# Altium project Current_source_koncar.PrjPcb (part 4 of 4)

## Sheet connectors.SchDoc
size 381 x 241 mm; SheetNumber: 9; SheetTotal: 10
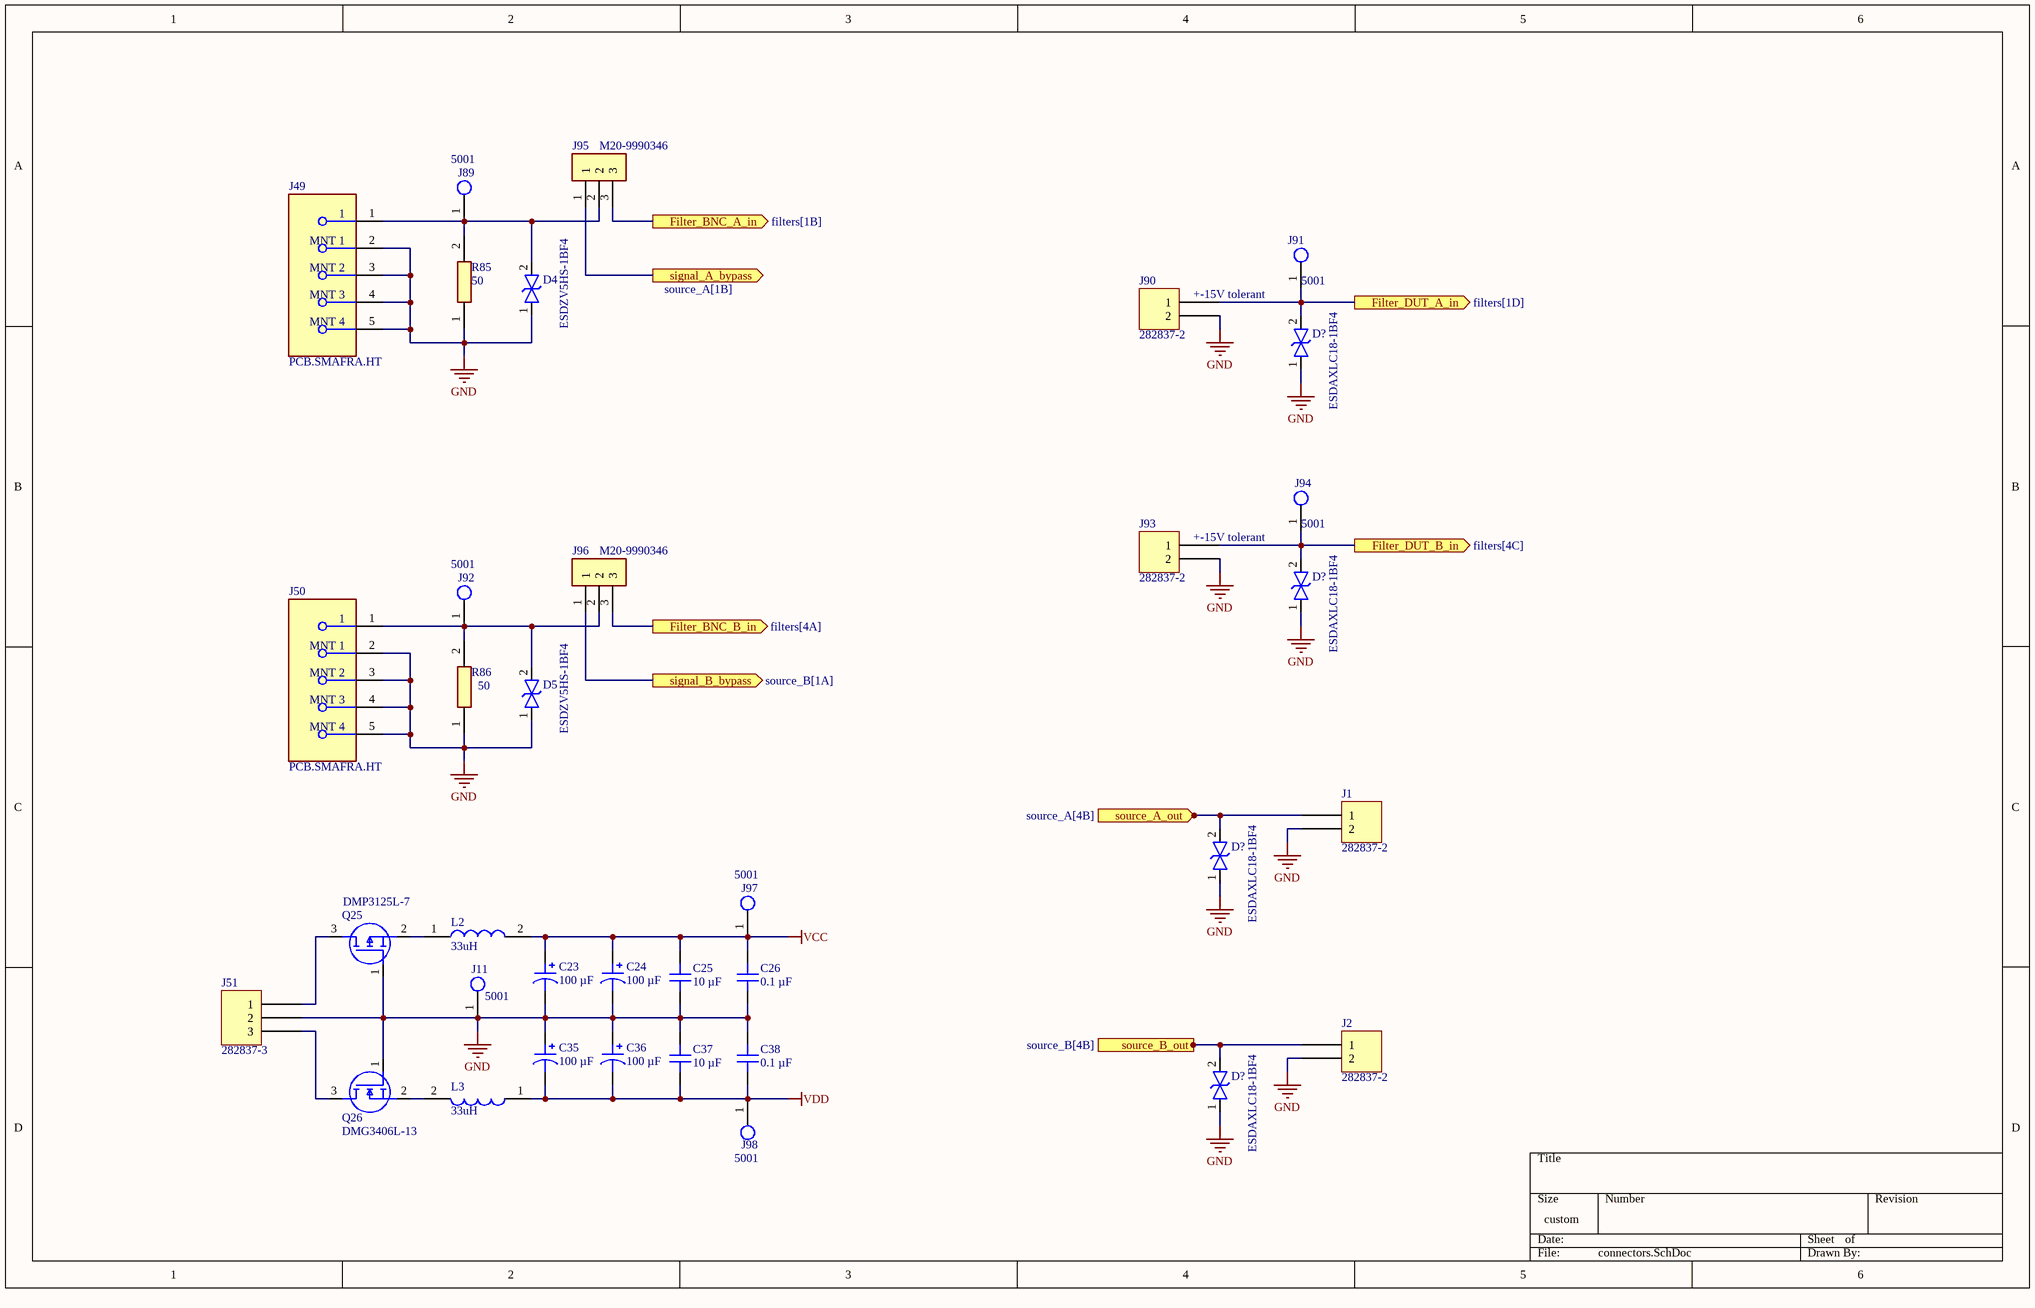
[diagram p9: connectors.SchDoc]

### Parts
(Parts that share a designator on the sheet are numbered #1, #2 ... from top to bottom, then left to right.)
C23  100 µF  [CAP ALSMD 8.3MM H10.5MM]
C24  100 µF  [CAP ALSMD 8.3MM H10.5MM]
C25  10 µF  [CAP 1206_3216 - 0.8MM]
C26  0.1 µF  [CAP 1206_3216 - 0.8MM]
C35  100 µF  [CAP ALSMD 8.3MM H10.5MM]
C36  100 µF  [CAP ALSMD 8.3MM H10.5MM]
C37  10 µF  [CAP 1206_3216 - 0.8MM]
C38  0.1 µF  [CAP 1206_3216 - 0.8MM]
D4  ESDZV5HS-1BF4  [ESDZV5HS1BF4]
D5  ESDZV5HS-1BF4  [ESDZV5HS1BF4]
D?#1  ESDAXLC18-1BF4  [ESDAXLC181BF4]
D?#2  ESDAXLC18-1BF4  [ESDAXLC181BF4]
D?#3  ESDAXLC18-1BF4  [ESDAXLC181BF4]
D?#4  ESDAXLC18-1BF4  [ESDAXLC181BF4]
J1  282837-2  [TE 282837-2]
J2  282837-2  [TE 282837-2]
J11  5001  [FP-5001-MFG]
J49  PCB.SMAFRA.HT  [FP-PCB_SMAFRA_HT-MFG]
J50  PCB.SMAFRA.HT  [FP-PCB_SMAFRA_HT-MFG]
J51  282837-3  [TE 282837-3]
J89  5001  [FP-5001-MFG]
J90  282837-2  [TE 282837-2]
J91  5001  [FP-5001-MFG]
J92  5001  [FP-5001-MFG]
J93  282837-2  [TE 282837-2]
J94  5001  [FP-5001-MFG]
J95  M20-9990346  [HDRV3W64P0X254_1X3_762X254X864P]
J96  M20-9990346  [HDRV3W64P0X254_1X3_762X254X864P]
J97  5001  [FP-5001-MFG]
J98  5001  [FP-5001-MFG]
L2  33uH  [INDPM116102X400N]
L3  33uH  [INDPM116102X400N]
Q25  DMP3125L-7  [SOT96P240X110-3N]
Q26  DMG3406L-13  [SOT96P240X110-3N]
R85  50  [RESC6332X65N]
R86  50  [RESC6332X65N]

### Ports
Filter_BNC_A_in (out, see filters[1B]), Filter_BNC_B_in (out, see filters[4A]), Filter_DUT_A_in (out, see filters[1D]), Filter_DUT_B_in (out, see filters[4C]), signal_A_bypass (out, see source_A[1B]), signal_B_bypass (out, see source_B[1A]), source_A_out (in, see source_A[4B]), source_B_out (in, see source_B[4B])

### Nets
GND: C23.2 C24.2 C25.1 C26.1 C35.1 C36.1 C37.2 C38.2 D4.1 D5.1 D?#1.1 D?#2.1 D?#3.1 D?#4.1 J1.2 J2.2 J11.1 J49.2(MNT_1) J49.3(MNT_2) J49.4(MNT_3) J49.5(MNT_4) J50.2(MNT_1) J50.3(MNT_2) J50.4(MNT_3) J50.5(MNT_4) J51.2 J90.2 J93.2 Q25.1(G) Q26.1(G) R85.1 R86.1
VCC: C23.1 C24.1 C25.2 C26.2 J97.1 L2.2
VDD: C35.2 C36.2 C37.1 C38.1 J98.1 L3.1
NetD4_2: D4.2 J49.1 J89.1 J95.2 R85.2
NetD5_2: D5.2 J50.1 J92.1 J96.2 R86.2
NetD?#1_2: D?#1.2 J90.1 J91.1 ; port Filter_DUT_A_in
NetD?#2_2: D?#2.2 J93.1 J94.1 ; port Filter_DUT_B_in
NetD?#3_2: D?#3.2 J1.1 ; port source_A_out
NetD?#4_2: D?#4.2 J2.1 ; port source_B_out
NetJ51_1: J51.1 Q25.3(D)
NetJ51_3: J51.3 Q26.3(D)
NetJ95_1: J95.1 ; port signal_A_bypass
NetJ95_3: J95.3 ; port Filter_BNC_A_in
NetJ96_1: J96.1 ; port signal_B_bypass
NetJ96_3: J96.3 ; port Filter_BNC_B_in
NetL2_1: L2.1 Q25.2(S)
NetL3_2: L3.2 Q26.2(S)

### Notes on the sheet
- (near J90) +-15V tolerant
- (near J93) +-15V tolerant

### Library data of the parts
C23 C24 C35 C36 = 50TZV100M8X10.5: CAP ALUM 100UF 20% 50V SMD; manufacturer: Rubycon; Impedance: 340 mOhms; Lifetime @ Temp.: 2000 Hrs @ 105°C; Polarization: Polar; Ripple Current @ High Frequency: 350 mA @ 100 kHz; Ripple Current @ Low Frequency: 175 mA @ 120 Hz; Surface Mount Land Size: 0.327" L x 0.327" W (8.30mm x 8.30mm); Part Number: 50TZV100M8X10.5; Applications: Automotive; Capacitance: 100 µF; componentlink1description: Datasheet; componentlink1url: http://www.rubycon.co.jp/en/catalog/e_pdfs/aluminum/e_tzv.pdf; componentlink2description: DigiKey Link; componentlink2url: https://www.digikey.com/en/products/detail/rubycon/50TZV100M8X10-5/3134931; Device Package: Radial, Can - SMD; Height - Seated (Max): 0.413" (10.50mm); lastupdated: 6/3/2024 20:15:48; Lifecycle Status: Active; Minimum Order: 1; Mounting Type: Surface Mount; Operating Temperature: -55°C ~ 105°C; Package / Case: Radial, Can - SMD; packaging: TapeAndReel; partid: 7533; Part Status: Active; price: 0.16; Ratings: AEC-Q200; series: TZV; Size / Dimension: 0.315" Dia (8.00mm); Supplier 1: DigiKey; Supplier Part Number 1: 1189-1651-1-ND; Tolerance: ±20%; value: 100 µF; Voltage - Rated: 50 V
C25 C37 = 885012208069: CAP CER 10UF 25V X7R 1206; manufacturer: Würth Elektronik; Tolerance: ±10%; Part Number: 885012208069; Capacitance: 10 µF; Applications: General Purpose; componentlink1description: Datasheet; componentlink1url: https://katalog.we-online.de/pbs/datasheet/885012208069.pdf; componentlink2description: DigiKey Link; componentlink2url: https://www.digikey.com/en/products/detail/würth-elektronik/885012208069/5453429; Device Package: 1206 (3216 Metric); lastupdated: 6/4/2024 19:10:32; Lifecycle Status: Active; Minimum Order: 1; Mounting Type: Surface Mount, MLCC; Operating Temperature: -55°C ~ 125°C; Package / Case: 1206 (3216 Metric); packaging: TapeAndReel; partid: 43199; Part Status: Active; price: 0.40; series: WCAP-CSGP; Size / Dimension: 0.126" L x 0.063" W (3.20mm x 1.60mm); Supplier 1: DigiKey; Supplier Part Number 1: 732-7574-1-ND; Temperature Coefficient: X7R; Thickness (Max): 0.075" (1.90mm); value: 10 µF; Voltage - Rated: 25V
C26 C38 = 885012208087: CAP CER 0.1UF 50V X7R 1206; manufacturer: Würth Elektronik; Tolerance: ±10%; Part Number: 885012208087; Capacitance: 0.1 µF; Applications: General Purpose; componentlink1description: Datasheet; componentlink1url: https://katalog.we-online.de/pbs/datasheet/885012208087.pdf; componentlink2description: DigiKey Link; componentlink2url: https://www.digikey.com/en/products/detail/würth-elektronik/885012208087/5453982; Device Package: 1206 (3216 Metric); lastupdated: 6/4/2024 19:10:27; Lifecycle Status: Active; Minimum Order: 1; Mounting Type: Surface Mount, MLCC; Operating Temperature: -55°C ~ 125°C; Package / Case: 1206 (3216 Metric); packaging: TapeAndReel; partid: 20879; Part Status: Active; price: 0.06; series: WCAP-CSGP; Size / Dimension: 0.126" L x 0.063" W (3.20mm x 1.60mm); Supplier 1: DigiKey; Supplier Part Number 1: 732-8127-1-ND; Temperature Coefficient: X7R; Thickness (Max): 0.035" (0.90mm); value: 0.1 µF; Voltage - Rated: 50V
D4 D5 = ESDZV5HS-1BF4: TVS Diode (Bi-directional); Manufacturer_Name: STMicroelectronics; Datasheet Link: https://www.st.com/resource/en/datasheet/esdzv5hs-1bf4.pdf; Height: 0.33mm; Manufacturer_Part_Number: ESDZV5HS-1BF4; Mouser Part Number: 511-ESDZV5HS-1BF4; Mouser Price/Stock: https://www.mouser.co.uk/ProductDetail/STMicroelectronics/ESDZV5HS-1BF4?qs=l7cgNqFNU1hPMpLiUWAylw%3D%3D; Arrow Part Number: ESDZV5HS-1BF4; Arrow Price/Stock: https://www.arrow.com/en/products/esdzv5hs-1bf4/stmicroelectronics?region=nac
D?#1-D?#4 = ESDAXLC18-1BF4: TVS Diode (Bi-directional); Manufacturer_Name: STMicroelectronics; Datasheet Link: https://www.st.com/resource/en/datasheet/esdaxlc18-1bf4.pdf; Height: 0.32mm; Manufacturer_Part_Number: ESDAXLC18-1BF4; Mouser Part Number: 511-ESDAXLC18-1BF4; Mouser Price/Stock: https://www.mouser.co.uk/ProductDetail/STMicroelectronics/ESDAXLC18-1BF4?qs=Mv7BduZupUgBxpJyOqfYsQ%3D%3D; Arrow Part Number: ESDAXLC18-1BF4; Arrow Price/Stock: https://www.arrow.com/en/products/esdaxlc18-1bf4/stmicroelectronics
J1 J2 J90 J93 = 282837-2: TERM BLK 2P SIDE ENT 5.08MM PCB; Manufacturer: TE Connectivity AMP Connectors; Current: 13.5 A; Mating Orientation: Horizontal with Board; Number of Levels: 1; Pitch: 0.200" (5.08mm); Positions Per Level: 2; Voltage: 300 V; Wire Gauge: 16-28 AWG; Wire Termination: Screw - Rising Cage Clamp; Part Number: 282837-2; Color: Green; ComponentLink1Description: Datasheet; ComponentLink1URL: https://www.te.com/commerce/DocumentDelivery/DDEController?Action=srchrtrv&DocNm=282837&DocType=Customer+Drawing&DocLang=English; ComponentLink2Description: DigiKey Link; ComponentLink2URL: https://www.digikey.com/en/products/detail/te-connectivity-amp-connectors/282837-2/2187973; Features: Interlocking (Side); LastUpdated: 6/21/2022 15:00:23; Lifecycle Status: Active; Minimum Order: 1; Mounting Type: Through Hole; Packaging: Tray; Part Status: Active; Price: 0.31; Series: Buchanan; Supplier 1: DigiKey; Supplier Part Number 1: A113320-ND
J11 J89 J91 J92 J94 J97 J98 = CMP-2000-05181-2: PC TEST POINT MINIATURE BLACK; Body Material: Bronze; Plating: Silver; Inside Diameter: 1.27mm; Hole Diameter: 1.6mm; Number of Ports: 1; Outside Diameter: 2.54mm; Insulation: Insulated; Insulation Material: Nylon; Mount: Through Hole; RoHS Compliant: Yes; Series: THM; Height: 0.3inch; Termination: Through Hole; Material: Nylon; Packaging: Bulk; Contact Material: Bronze; REACH SVHC: No SVHC; Contact Plating: Silver; Orientation: Straight; Lead Free: Lead Free; Package Quantity: 100; Length: 7.62mm; Flammability Rating: UL94 V-0; Number of Contacts: 1; Diameter: 2.54mm; Housing Color: Black; Color: Black
J49 J50 = CMP-111093-000003-1: CONN SMA JACK R/A 50OHM PCB; Dielectric Material: PTFE; Max Frequency: 6GHz; Body Material: Brass; Center Contact Plating: Gold; Voltage Rating: 500V; Operating Frequency: 0 to 6 GHz; Number of Ports: 1; Impedance: 50R; Housing Color: Gold; Mount: Through Hole; Orientation: Right Angle; Termination: Solder; Contact Material: Brass; Series: -; Contact Plating: Gold; Fastening Type: Threaded; Connector Type: SMA; Package Quantity: 500; Case/Package: SMA; Body Plating: Gold; Frequency: 6GHz; Packaging: Tray
J51 = 282837-3: TERM BLK 3P SIDE ENT 5.08MM PCB; Manufacturer: TE Connectivity AMP Connectors; Current: 13.5 A; Mating Orientation: Horizontal with Board; Number of Levels: 1; Pitch: 0.200" (5.08mm); Positions Per Level: 3; Voltage: 300 V; Wire Gauge: 16-28 AWG; Wire Termination: Screw - Rising Cage Clamp; Part Number: 282837-3; Color: Green; ComponentLink1Description: Datasheet; ComponentLink1URL: https://www.te.com/commerce/DocumentDelivery/DDEController?Action=srchrtrv&DocNm=282837&DocType=Customer+Drawing&DocLang=English; ComponentLink2Description: DigiKey Link; ComponentLink2URL: https://www.digikey.com/en/products/detail/te-connectivity-amp-connectors/282837-3/2187974; Features: Interlocking (Side); LastUpdated: 6/21/2022 15:00:39; Lifecycle Status: Active; Minimum Order: 1; Mounting Type: Through Hole; Packaging: Tray; Part Status: Active; Price: 0.47; Series: Buchanan; Supplier 1: DigiKey; Supplier Part Number 1: A113321-ND
J95 J96 = M20-9990346: Connector; Manufacturer_Name: Harwin; Datasheet Link: https://cdn.harwin.com/pdfs/M20-999.pdf; Height: 8.64mm; Manufacturer_Part_Number: M20-9990346; Mouser Part Number: 855-M20-9990346; Mouser Price/Stock: https://www.mouser.co.uk/ProductDetail/Harwin/M20-9990346?qs=ulE8k0yEMYbyhQ3uXpFs8Q%3D%3D
L2 L3 = AMRM00101040330MA1: Inductor; Manufacturer_Name: Pulse Electronics; Datasheet Link: https://productfinder.pulseelectronics.com/api/open/part-attachments/datasheet/amrm00101040330ma1; Height: 4mm; Manufacturer_Part_Number: AMRM00101040330MA1; Mouser Part Number: 673-AMRM101040330MA1; Mouser Price/Stock: https://www.mouser.co.uk/ProductDetail/Pulse-Electronics/AMRM00101040330MA1?qs=HoCaDK9Nz5eI6M5ad0CXDA%3D%3D; Value: 33uH
Q25 = DMP3125L-7: MOSFET (P-Channel); Manufacturer_Name: Diodes Incorporated; Datasheet Link: https://www.diodes.com//assets/Datasheets/DMP3125L.pdf; Height: 1.1mm; Manufacturer_Part_Number: DMP3125L-7; Mouser Part Number: 621-DMP3125L-7; Mouser Price/Stock: https://www.mouser.co.uk/ProductDetail/Diodes-Incorporated/DMP3125L-7?qs=W0yvOO0ixfH8ma8MdHfXQA%3D%3D; Arrow Part Number: DMP3125L-7; Arrow Price/Stock: https://www.arrow.com/en/products/dmp3125l-7/diodes-incorporated?region=nac
Q26 = DMG3406L-13: MOSFET (N-Channel); Manufacturer_Name: Diodes Incorporated; Datasheet Link: https://www.diodes.com//assets/Datasheets/DMG3406L.pdf; Height: 1.1mm; Manufacturer_Part_Number: DMG3406L-13; Mouser Part Number: 621-DMG3406L-13; Mouser Price/Stock: https://www.mouser.co.uk/ProductDetail/Diodes-Incorporated/DMG3406L-13?qs=BvpHGKeVh3r%252BRZTTCOfjpg%3D%3D; Arrow Part Number: DMG3406L-13; Arrow Price/Stock: https://www.arrow.com/en/products/dmg3406l-13/diodes-incorporated?region=nac
R85 R86 = RNCL2512FT50R0: Resistor; Manufacturer_Name: Stackpole Electronics; Datasheet Link: https://www.seielect.com/catalog/sei-rncl.pdf; Height: 0.65mm; Manufacturer_Part_Number: RNCL2512FT50R0; Resistance: 50

## Sheet LCD.SchDoc
size A; SheetNumber: 10; SheetTotal: 10
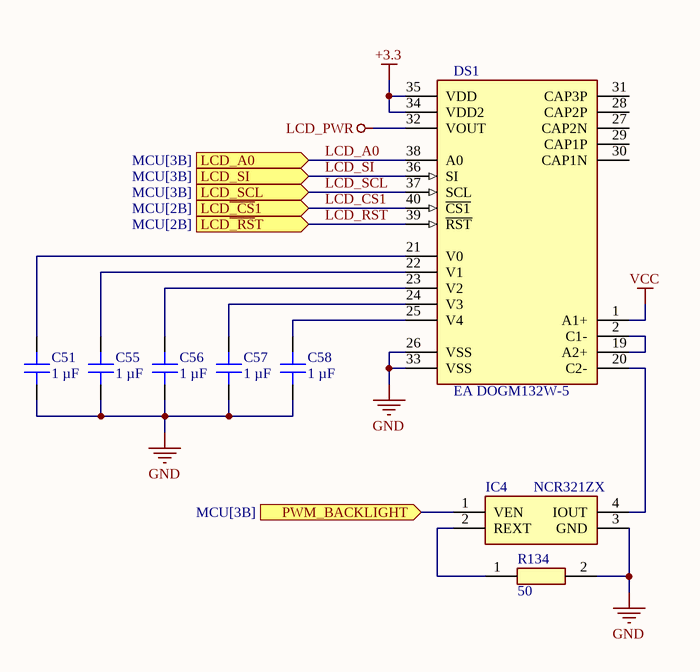
[diagram p10: LCD.SchDoc]

### Parts
C51  1 µF  [CAP 1206_3216 - 0.8MM]
C55  1 µF  [CAP 1206_3216 - 0.8MM]
C56  1 µF  [CAP 1206_3216 - 0.8MM]
C57  1 µF  [CAP 1206_3216 - 0.8MM]
C58  1 µF  [CAP 1206_3216 - 0.8MM]
DS1  EA DOGM132W-5  [FP-EA_DOGM132L-5-MFG]
IC4  NCR321ZX  [SOT230P700X180-4N]
R134  50  [RESC6332X65N]

### Ports
LCD_A0 (in, see MCU[3B]), LCD_SCL (in, see MCU[3B]), LCD_SI (in, see MCU[3B]), LCD~{_CS}1 (in, see MCU[2B]), LCD~{_RS}T (in, see MCU[2B]), PWM_BACKLIGHT (in, see MCU[3B])

### Nets
+3.3: DS1.34(VDD2) DS1.35(VDD)
GND: C51.1 C55.1 C56.1 C57.1 C58.1 DS1.26(VSS) DS1.33(VSS) IC4.3(GND) R134.2
LCD_PWR: DS1.32(VOUT)
VCC: DS1.1(A1+)
LCD~{_CS}1: DS1.40(~{CS1}) ; port LCD~{_CS}1
LCD~{_RS}T: DS1.39(~{RST}) ; port LCD~{_RS}T
LCD_A0: DS1.38(A0) ; port LCD_A0
LCD_SCL: DS1.37(SCL) ; port LCD_SCL
LCD_SI: DS1.36(SI) ; port LCD_SI
NetC51_2: C51.2 DS1.21(V0)
NetC55_2: C55.2 DS1.22(V1)
NetC56_2: C56.2 DS1.23(V2)
NetC57_2: C57.2 DS1.24(V3)
NetC58_2: C58.2 DS1.25(V4)
NetDS1_2: DS1.2(C1-) DS1.19(A2+)
NetDS1_20: DS1.20(C2-) IC4.4(IOUT)
NetIC2_34: IC4.1(VEN) ; port PWM_BACKLIGHT
NetIC4_2: IC4.2(REXT) R134.1

Not connected (* = marked no-connect by the designer): DS1 27(CAP2N) 28(CAP2P) 29(CAP1P) 30(CAP1N) 31(CAP3P)

### Library data of the parts
C51 C55-C58 = 885012208093: CAP CER 1UF 50V X7R 1206; manufacturer: Würth Elektronik; Tolerance: ±10%; Part Number: 885012208093; Capacitance: 1 µF; Applications: General Purpose; componentlink1description: Datasheet; componentlink1url: https://katalog.we-online.de/pbs/datasheet/885012208093.pdf; componentlink2description: DigiKey Link; componentlink2url: https://www.digikey.com/en/products/detail/würth-elektronik/885012208093/5453432; Device Package: 1206 (3216 Metric); lastupdated: 6/4/2024 19:10:33; Lifecycle Status: Active; Minimum Order: 1; Mounting Type: Surface Mount, MLCC; Operating Temperature: -55°C ~ 125°C; Package / Case: 1206 (3216 Metric); packaging: TapeAndReel; partid: 39665; Part Status: Active; price: 0.10; series: WCAP-CSGP; Size / Dimension: 0.126" L x 0.063" W (3.20mm x 1.60mm); Supplier 1: DigiKey; Supplier Part Number 1: 732-7577-1-ND; Temperature Coefficient: X7R; Thickness (Max): 0.075" (1.90mm); value: 1 µF; Voltage - Rated: 50V
DS1 = CMP-137185-000001-1: LCD MOD GRAPH 132X32 Y/G; Supply Current: 140uA; Background Color: Green; Resolution (height): 32pixel; Fluid Type: STN POSITIVE; Interface: SPI; Viewing Area (width): 51mm; Resolution (width): 132pixel; Viewing Area (height): 15mm; RoHS Compliant: No; Height: 27.94mm; Min Operating Temperature: -20°C; Packaging: Bulk; Max Operating Temperature: 70°C; Nominal Supply Current: 140uA; Series: EA DOGM; Width: 55mm
IC4 = NCR321ZX: Integrated Circuit; Manufacturer_Name: Nexperia; Datasheet Link: https://componentsearchengine.com/Datasheets/2/NCR321ZX.pdf; Height: 1.8mm; Manufacturer_Part_Number: NCR321ZX; Mouser Part Number: 771-NCR321ZX; Mouser Price/Stock: https://www.mouser.co.uk/ProductDetail/Nexperia/NCR321ZX?qs=ahcBuItHZ3zTr8W8PrL%2FCg%3D%3D; Arrow Part Number: NCR321ZX; Arrow Price/Stock: https://www.arrow.com/en/products/ncr321zx/nexperia?region=nac
R134 = RNCL2512FT50R0: as R85 on sheet connectors; Datasheet Link: https://www.seielect.com/catalog/sei-rncl.pdf; Height: 0.65mm; Manufacturer_Part_Number: RNCL2512FT50R0; Resistance: 50

## Sheet resistors.SchDoc
size 381 x 241 mm; SheetNumber: 12; SheetTotal: 12
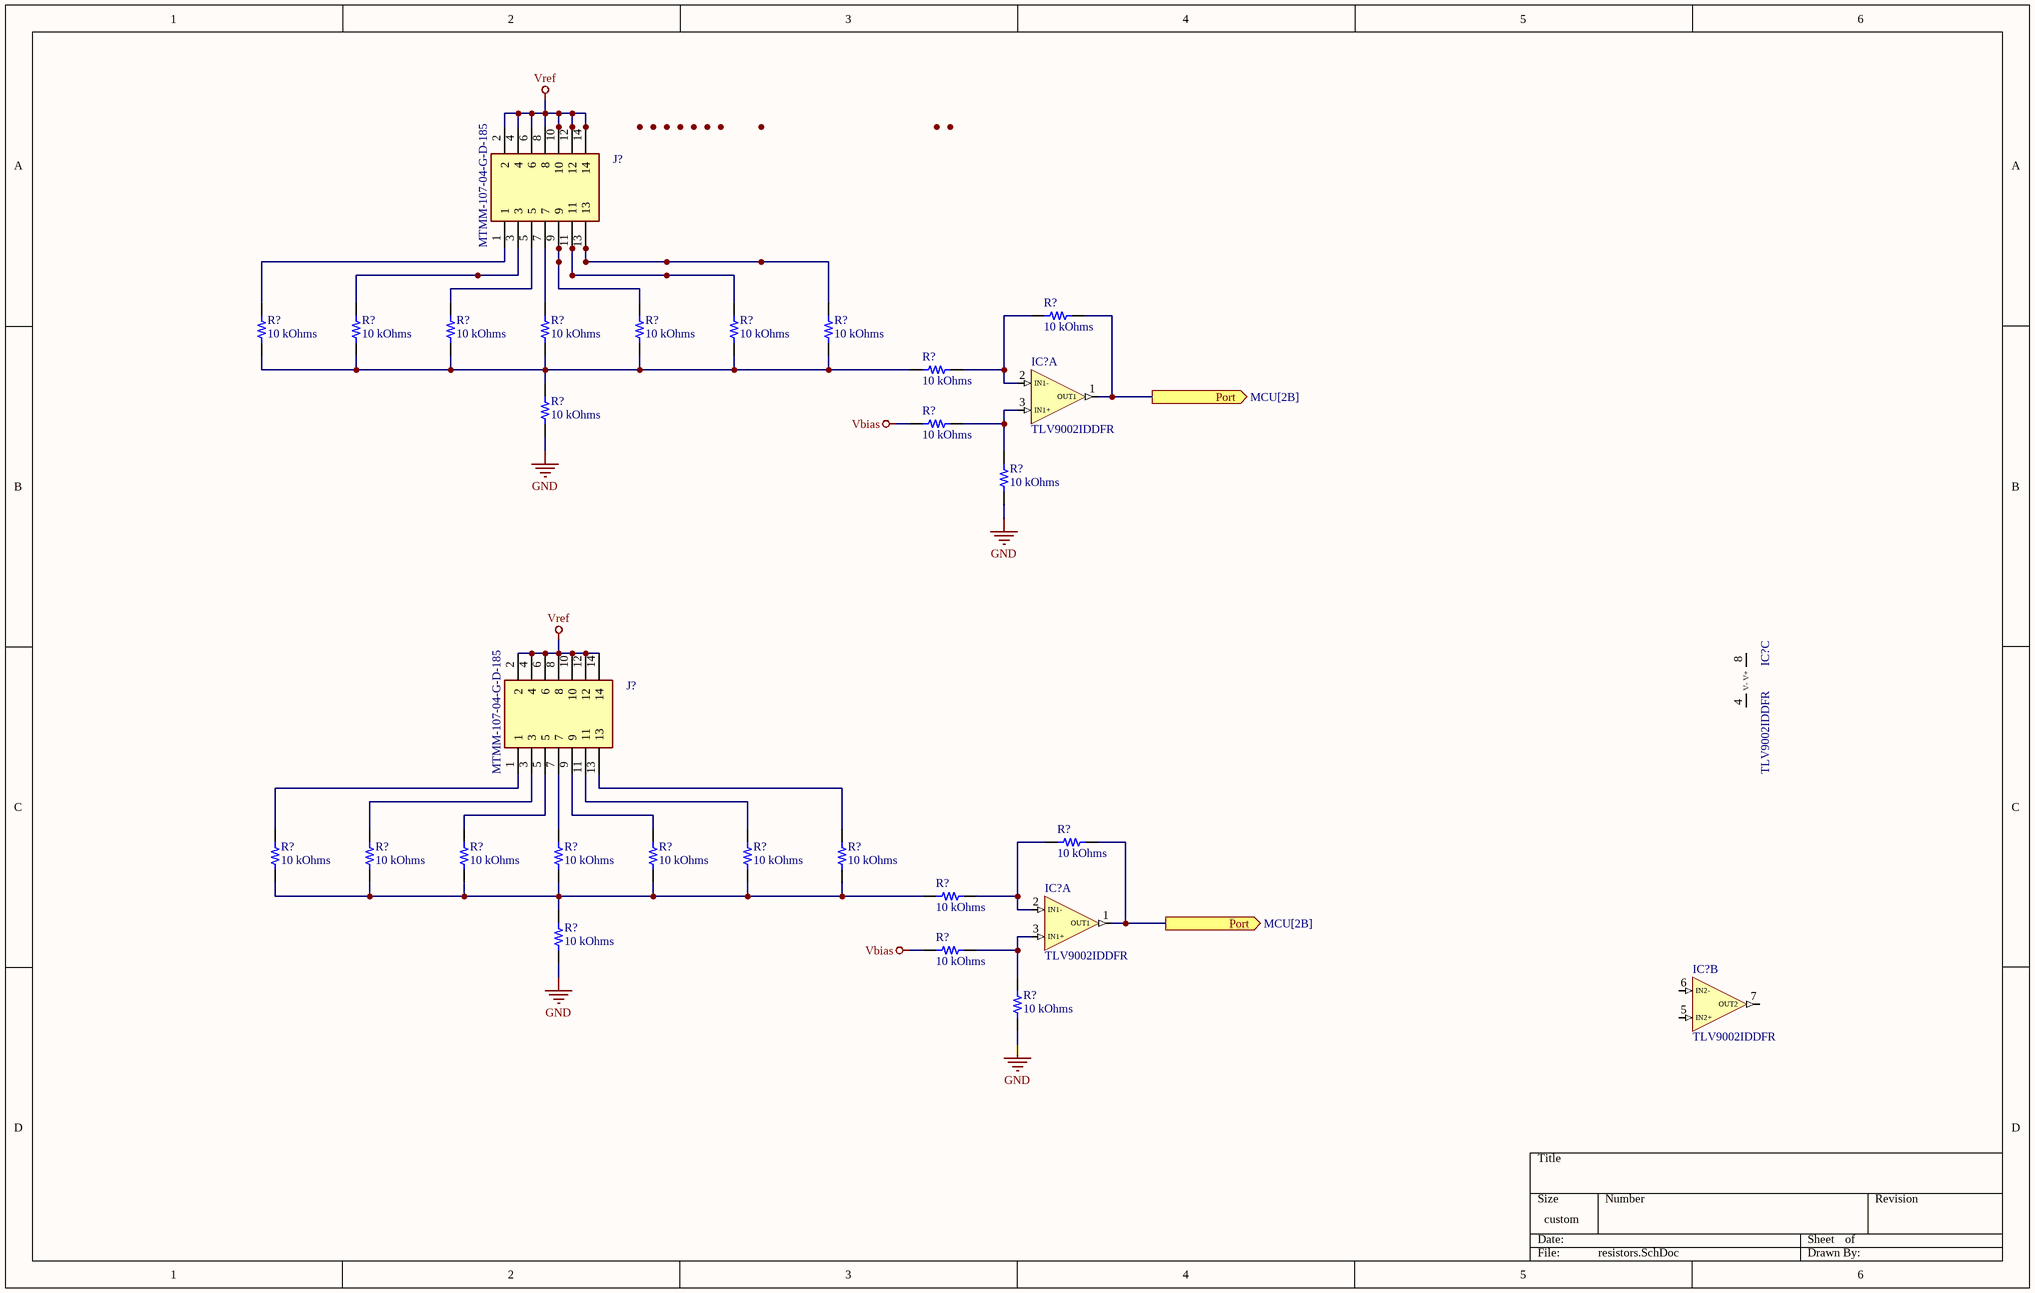
[diagram p11: resistors.SchDoc]

### Parts
(Parts that share a designator on the sheet are numbered #1, #2 ... from top to bottom, then left to right.)
IC?#7  TLV9002IDDFR  [SOT65P280X110-8N]  (part A of 3)
IC?#8  TLV9002IDDFR  [SOT65P280X110-8N]  (part C of 3)
IC?#9  TLV9002IDDFR  [SOT65P280X110-8N]  (part A of 3)
IC?#10  TLV9002IDDFR  [SOT65P280X110-8N]  (part B of 3)
J?#1  MTMM-107-04-G-D-185  [MTMM10704GD185]
J?#2  MTMM-107-04-G-D-185  [MTMM10704GD185]
R?#23  10 kOhms  [YAGEO RES 1206_3216]
R?#24  10 kOhms  [YAGEO RES 1206_3216]
R?#25  10 kOhms  [YAGEO RES 1206_3216]
R?#26  10 kOhms  [YAGEO RES 1206_3216]
R?#27  10 kOhms  [YAGEO RES 1206_3216]
R?#28  10 kOhms  [YAGEO RES 1206_3216]
R?#29  10 kOhms  [YAGEO RES 1206_3216]
R?#30  10 kOhms  [YAGEO RES 1206_3216]
R?#31  10 kOhms  [YAGEO RES 1206_3216]
R?#32  10 kOhms  [YAGEO RES 1206_3216]
R?#33  10 kOhms  [YAGEO RES 1206_3216]
R?#34  10 kOhms  [YAGEO RES 1206_3216]
R?#35  10 kOhms  [YAGEO RES 1206_3216]
R?#36  10 kOhms  [YAGEO RES 1206_3216]
R?#37  10 kOhms  [YAGEO RES 1206_3216]
R?#38  10 kOhms  [YAGEO RES 1206_3216]
R?#39  10 kOhms  [YAGEO RES 1206_3216]
R?#40  10 kOhms  [YAGEO RES 1206_3216]
R?#41  10 kOhms  [YAGEO RES 1206_3216]
R?#42  10 kOhms  [YAGEO RES 1206_3216]
R?#43  10 kOhms  [YAGEO RES 1206_3216]
R?#44  10 kOhms  [YAGEO RES 1206_3216]
R?#45  10 kOhms  [YAGEO RES 1206_3216]
R?#46  10 kOhms  [YAGEO RES 1206_3216]

### Ports
Port (out, see MCU[2B])

### Nets
GND: R?#32.1 R?#34.1 R?#44.1 R?#46.1
Vbias: R?#33.2 R?#45.2
Vref: J?#1.2 J?#1.4 J?#1.6 J?#1.8 J?#1.10 J?#1.12 J?#1.14 J?#2.2 J?#2.4 J?#2.6 J?#2.8 J?#2.10 J?#2.12 J?#2.14
NetIC2_43: IC?#7.1(OUT1) IC?#9.1(OUT1) R?#23.1 R?#35.1 ; port Port
NetIC?#7_2: IC?#7.2(IN1-) R?#23.2 R?#31.1
NetIC?#7_3: IC?#7.3(IN1+) R?#33.1 R?#34.2
NetIC?#9_2: IC?#9.2(IN1-) R?#35.2 R?#43.1
NetIC?#9_3: IC?#9.3(IN1+) R?#45.1 R?#46.2
NetJ?#1_1: J?#1.1 R?#24.2
NetJ?#1_3: J?#1.3 R?#25.2
NetJ?#1_5: J?#1.5 R?#26.2
NetJ?#1_7: J?#1.7 R?#27.2
NetJ?#1_9: J?#1.9 R?#28.2
NetJ?#1_11: J?#1.11 R?#29.2
NetJ?#1_13: J?#1.13 R?#30.2
NetJ?#2_1: J?#2.1 R?#36.2
NetJ?#2_3: J?#2.3 R?#37.2
NetJ?#2_5: J?#2.5 R?#38.2
NetJ?#2_7: J?#2.7 R?#39.2
NetJ?#2_9: J?#2.9 R?#40.2
NetJ?#2_11: J?#2.11 R?#41.2
NetJ?#2_13: J?#2.13 R?#42.2
NetR?#24_1: R?#24.1 R?#25.1 R?#26.1 R?#27.1 R?#28.1 R?#29.1 R?#30.1 R?#31.2 R?#32.2
NetR?#36_1: R?#36.1 R?#37.1 R?#38.1 R?#39.1 R?#40.1 R?#41.1 R?#42.1 R?#43.2 R?#44.2

Not connected (* = marked no-connect by the designer): IC?#8 4(V-) 8(V+); IC?#10 5(IN2+) 6(IN2-) 7(OUT2)

### Library data of the parts
IC?#7-IC?#10 = TLV9002IDDFR: Integrated Circuit; Manufacturer_Name: Texas Instruments; Datasheet Link: https://www.ti.com/lit/gpn/TLV9002; Height: 1.1mm; Manufacturer_Part_Number: TLV9002IDDFR; Mouser Part Number: 595-TLV9002IDDFR; Mouser Price/Stock: https://www.mouser.co.uk/ProductDetail/Texas-Instruments/TLV9002IDDFR?qs=mAH9sUMRCtuVJ6NmNV%252Bgrw%3D%3D; Arrow Part Number: TLV9002IDDFR; Arrow Price/Stock: https://www.arrow.com/en/products/tlv9002iddfr/texas-instruments?utm_currency=USD&region=nac
J?#1 J?#2 = MTMM-107-04-G-D-185: Connector; Manufacturer_Name: SAMTEC; Datasheet Link: https://suddendocs.samtec.com/prints/mtmm-1xx-xx-xx-x-xxx-xx-xxx-mkt.pdf?_gl=1*gklr36*_gcl_aw*R0NMLjE3NDEzMjczNDIuQ2p3S0NBaUFyS1ctQmhBekVpd0FaaFdzSU81NXRXcmh5VS16b3pEZ1BfdFZablZIZUl1bFk4SG5uQlVzb0JsazkxbHVlaFo1OVhKaGZCb0N5SGtRQXZEX0J3RQ..*_gcl_au*OTA0NjU5; Height: 8.333mm; Manufacturer_Part_Number: MTMM-107-04-G-D-185; Mouser Part Number: 200-MTMM10704GD185; Mouser Price/Stock: https://www.mouser.co.uk/ProductDetail/Samtec/MTMM-107-04-G-D-185?qs=DJA8%252BIqD56WvW%2Fj12n4w4g%3D%3D
R?#23-R?#46 = RT1206FRE0710KL: RES SMD 10K OHM 1% 1/4W 1206; Manufacturer: Yageo; Power (Watts): 0.25W, 1/4W; Temperature Coefficient: ±50ppm/°C; Part Number: RT1206FRE0710KL; ComponentLink1Description: Datasheet; ComponentLink1URL: https://www.yageo.com/upload/media/product/productsearch/datasheet/rchip/PYu-RT_1-to-0.01_RoHS_L_11.pdf; ComponentLink2Description: DigiKey Link; ComponentLink2URL: https://www.digikey.com/en/products/detail/yageo/RT1206FRE0710KL/1082868; Composition: Thin Film; Device Package: 1206 (3216 Metric); Height - Seated (Max): 0.026" (0.65mm); LastUpdated: 7/25/2024 09:21:28; Lifecycle Status: Active; Minimum Order: 1; Number of Terminations: 2; Operating Temperature: -55°C ~ 155°C; Package / Case: 1206 (3216 Metric); Packaging: TapeAndReel; PartId: 38903; Part Status: Active; Price: 0.01; Resistance: 10 kOhms; Series: RT; Size / Dimension: 0.122" L x 0.063" W (3.10mm x 1.60mm); Supplier 1: DigiKey; Supplier Part Number 1: YAG1242CT-ND; Supplier Device Package: 1206; Tolerance: ±1%; Value: 10 kOhms

## Nets that join several sheets
+3.3: power (9 pins), MCU (IC2.4 IC2.6), misc (R68.1 R69.1), LCD (DS1.34 DS1.35)
GND: source_A (6 pins), source_B (6 pins), vca_A (C54.1 R22.2 R36.1), vca_B (C111.1 R108.2 R122.1), filters (12 pins), power (60 pins), MCU (5 pins), LDO (14 pins), misc (22 pins), connectors (32 pins), LCD (9 pins), resistors (R?#32.1 R?#34.1 R?#44.1 R?#46.1)
LCD_PWR: power (C62.2 C63.2 R67.2 U9.1), LCD (DS1.32)
VCC: source_A (Q1.3 Q2.7_8 R1.2 R2.2), source_B (Q13.3 Q14.7_8 R87.2 R88.2), power (7 pins), LDO (5 pins), connectors (6 pins), LCD (DS1.1)
VCC_filtered: power (C9.1 C10.1 U5.8), LDO (C29.2 L1.2 R48.2 R50.1)
VCC_LDO_OUT: vca_A (5 pins), vca_B (5 pins), power (21 pins), LDO (6 pins)
VDD: source_A (Q2.5_6 Q4.3 R9.1 R10.1), source_B (Q14.5_6 Q16.3 R95.1 R96.1), LDO (5 pins), connectors (6 pins)
VDD_filtered: power (C20.2 C21.2 U5.4), LDO (C30.2 L4.2 R55.2 R56.2)
VDD_LDO_OUT: vca_A (5 pins), vca_B (5 pins), power (21 pins), LDO (6 pins)
Vref: vca_A (R29.2), vca_B (R115.2), filters (6 pins), power (13 pins), MCU (IC2.5), misc (C39.2 C50.2 IC6.1), resistors (14 pins)
LCD~{_CS}1: MCU (IC2.40), LCD (DS1.40)
LCD~{_RS}T: MCU (IC2.41), LCD (DS1.39)
LCD_A0: MCU (IC2.37), LCD (DS1.38)
LCD_SCL: MCU (IC2.39), LCD (DS1.37)
LCD_SI: MCU (IC2.38), LCD (DS1.36)
LDO_EN: power (U9.5), MCU (IC2.35 R66.1), LDO (U4.5 U6.3)
NetC52_1: MCU (IC2.8), misc (C52.1 Y1.1)
NetC53_2: MCU (IC2.9), misc (C53.2 Y1.3)
NetC69_2: MCU (IC2.29), misc (C69.2 J88.1 R71.2)
NetC70_2: MCU (IC2.30), misc (C70.2 J87.1 R70.2)
NetC81_1: filters (C81.1 IC?#4.1 IC?#4.2), MCU (IC2.14 IC2.17)
NetC85_1: filters (C85.1 IC?#6.6 IC?#6.7), MCU (IC2.15 IC2.18)
NetC?#3_1: filters (C?#3.1 IC?#2.1 IC?#2.2), MCU (IC2.13 IC2.16)
NetD?#1_2: filters (R?#21.1), connectors (D?#1.2 J90.1 J91.1)
NetD?#2_2: filters (R?#17.1), connectors (D?#2.2 J93.1 J94.1)
NetD?#3_2: source_A (J9.1 R5.1 R63.1), connectors (D?#3.2 J1.1)
NetD?#4_2: source_B (J57.1 R91.1 R150.1), connectors (D?#4.2 J2.1)
NetIC2_25: MCU (IC2.25), misc (S1.3 S1.4)
NetIC2_26: MCU (IC2.26), misc (S2.3 S2.4)
NetIC2_27: MCU (IC2.27), misc (S4.3 S4.4)
NetIC2_28: MCU (IC2.28), misc (S3.3 S3.4)
NetIC2_31: MCU (IC2.31), misc (SW1.2)
NetIC2_32: MCU (IC2.32), misc (IC6.4)
NetIC2_33: MCU (IC2.33), misc (IC6.5)
NetIC2_34: MCU (IC2.34), LCD (IC4.1)
NetIC2_36: MCU (IC2.36), misc (LS1.1)
NetIC2_43: MCU (IC2.43 IC2.44 IC2.45), resistors (IC?#7.1 IC?#9.1 R?#23.1 R?#35.1)
NetIC2_47: MCU (IC2.47), misc (IC6.2)
NetIC2_48: MCU (IC2.48), misc (IC6.3)
NetIC6_6: vca_A (R28.1), misc (IC6.6)
NetIC6_7: vca_A (R27.1), misc (IC6.7)
NetIC6_8: vca_B (R114.1), misc (IC6.8)
NetIC6_9: vca_B (R113.1), misc (IC6.9)
NetJ14_1: source_A (J14.1), vca_A (R21.1 U3.1)
NetJ20_1: source_B (J20.1), vca_B (R107.1 U15.1)
NetJ24_1: source_A (5 pins), filters (R?#14.1)
NetJ69_1: source_B (5 pins), filters (R?#10.1)
NetJ95_1: source_A (R61.2), connectors (J95.1)
NetJ95_3: filters (R?#6.1), connectors (J95.3)
NetJ96_1: source_B (R148.2), connectors (J96.1)
NetJ96_3: filters (R?#2.1), connectors (J96.3)